# EAGLE design JabberMaster (EAGLE 5.11)
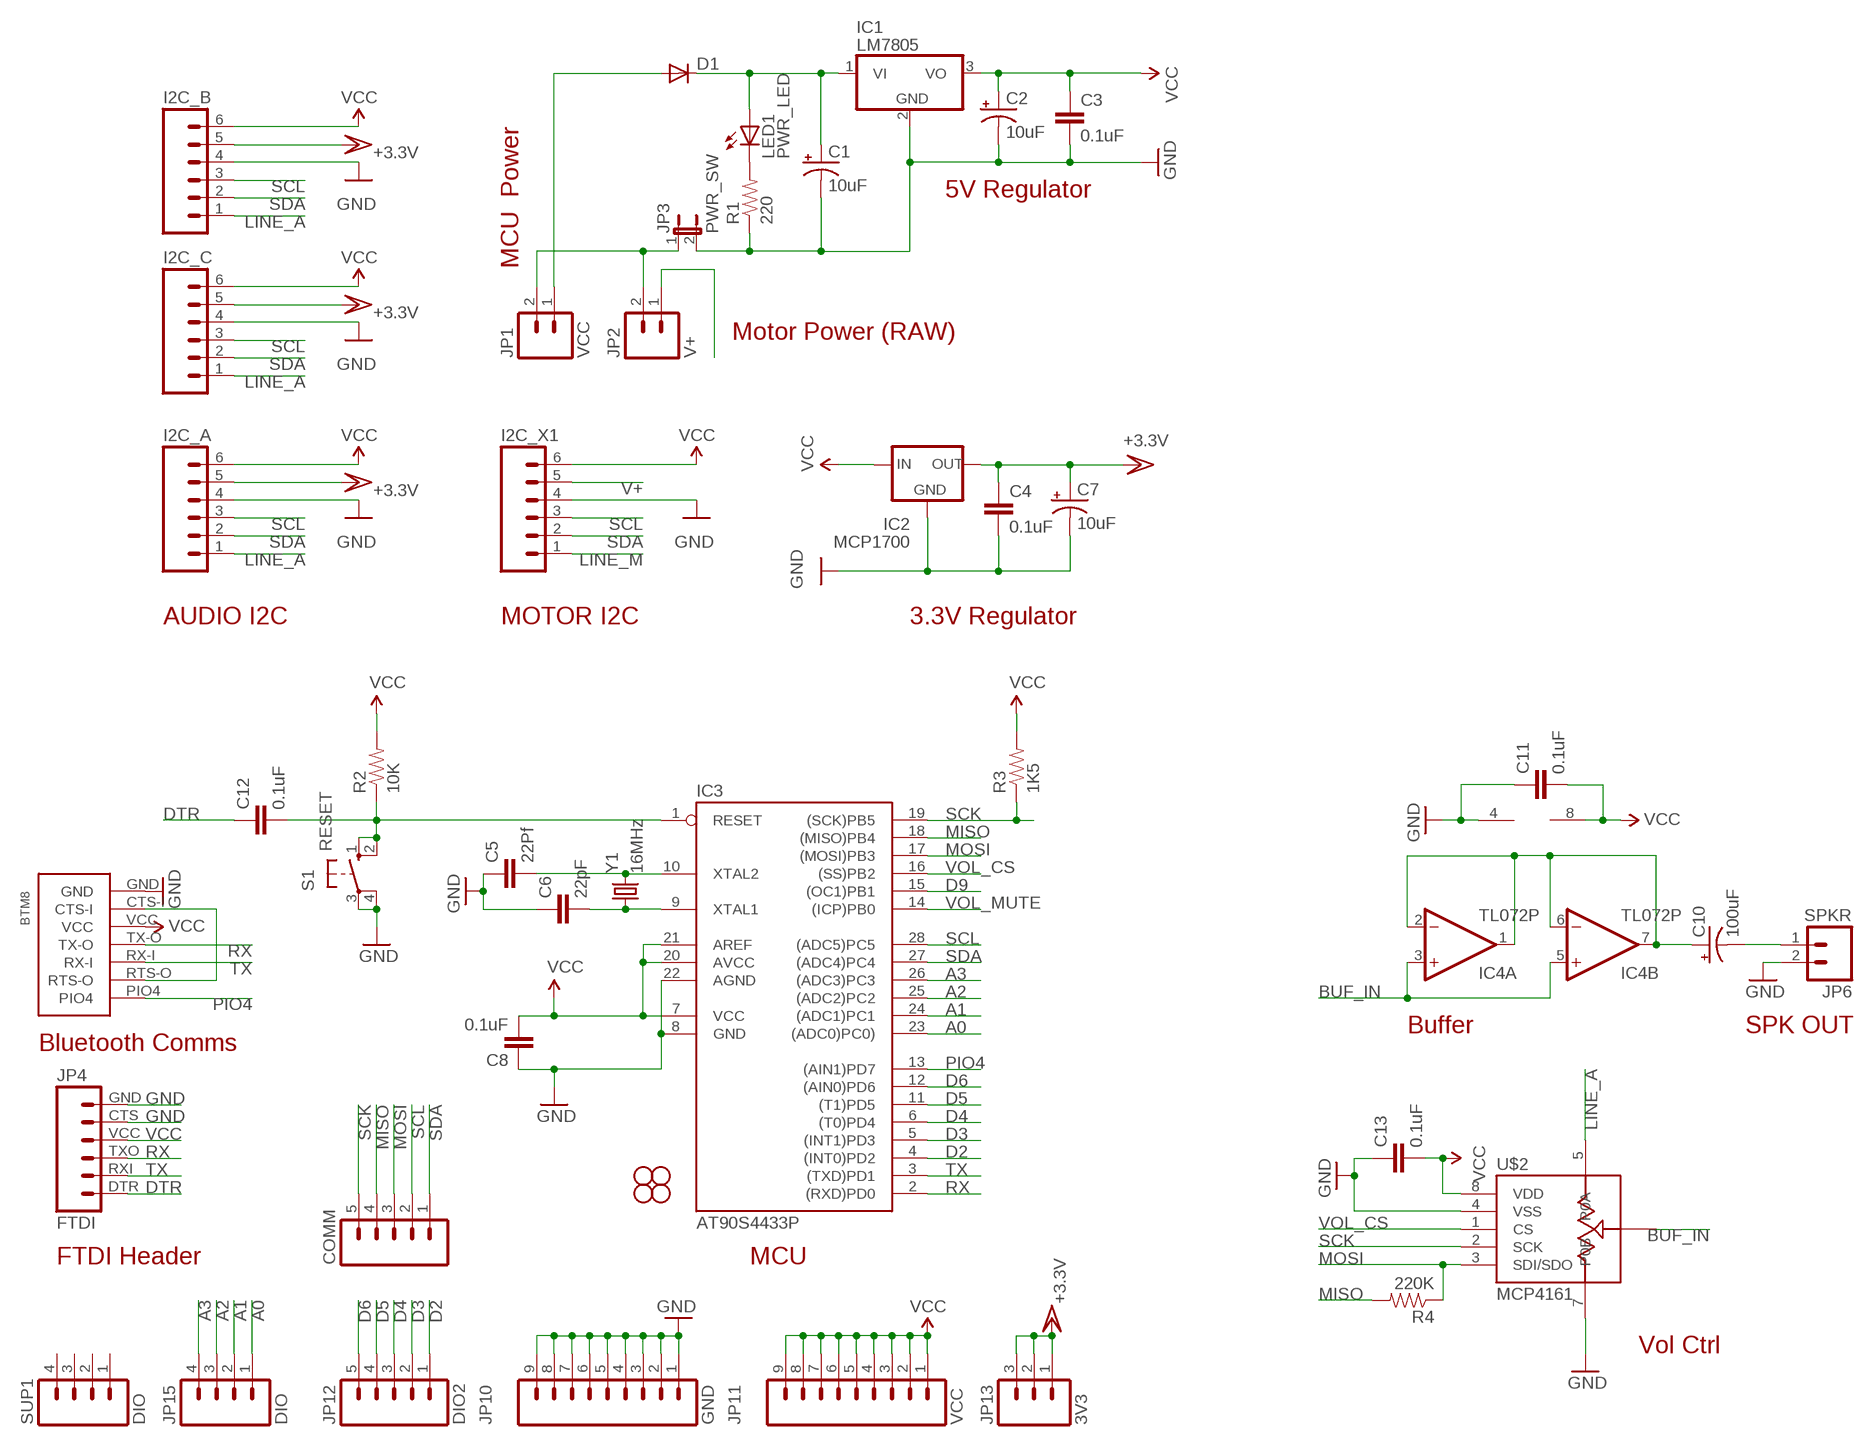
[diagram p0: schematic, sheet 1]

## Parts
BTM8  BLUETOOTH_MATE_SILVER  BLUETOOTH_MATE90FEMALE  [BLUETOOTH_MATE_90FEMALE]
C1  10uF  CAP_POLPTH2  [CPOL-RADIAL-10UF-25V]
C2  10uF  CAP_POLPTH2  [CPOL-RADIAL-10UF-25V]
C3  0.1uF  CAPPTH  [CAP-PTH-SMALL]
C4  0.1uF  CAPPTH  [CAP-PTH-SMALL]
C5  22Pf  CAPPTH  [CAP-PTH-SMALL]
C6  22pF  CAPPTH  [CAP-PTH-SMALL]
C7  10uF  CAP_POLPTH2  [CPOL-RADIAL-10UF-25V]
C8  0.1uF  CAPPTH  [CAP-PTH-SMALL]
C10  100uF  CAP_POLPTH2  [CPOL-RADIAL-10UF-25V]
C11  0.1uF  CAPPTH  [CAP-PTH-SMALL]
C12  0.1uF  CAPPTH  [CAP-PTH-SMALL]
C13  0.1uF  CAPPTH  [CAP-PTH-SMALL]
COMM  M05LOCK  [1X05_LOCK]
D1  DIODE1N4148  [DIODE-1N4148]
I2C_A  M06POLAR_LOCK  [MOLEX-1X6_LOCK]
I2C_B  M06POLAR_LOCK  [MOLEX-1X6_LOCK]
I2C_C  M06POLAR_LOCK  [MOLEX-1X6_LOCK]
I2C_X1  M06POLAR_LOCK  [MOLEX-1X6_LOCK]
IC1  LM7805  7805TV  [TO220V]
IC2  MCP1700  MCP1700INLINE  [TO92-INLINE]
IC3  AT90S4433P  [DIL28-3]
IC4  TL072P  [DIL08]
JP1  VCC  M02POLAR_LOCK  [MOLEX-1X2_LOCK]
JP2  V+  M02POLAR_LOCK  [MOLEX-1X2_LOCK]
JP3  PWR_SW  JUMPER-2PTH  [1X02]
JP4  FTDI  FTDI_BASICPTH  [FTDI_BASIC]
JP5  STAND-OFF  [STAND-OFF]
JP6  SPKR  M02POLAR_LOCK  [MOLEX-1X2_LOCK]
JP7  STAND-OFF  [STAND-OFF]
JP8  STAND-OFF  [STAND-OFF]
JP9  STAND-OFF  [STAND-OFF]
JP10  GND  M09LOCK  [1X09_LOCK]
JP11  VCC  M09LOCK  [1X09_LOCK]
JP12  DIO2  M05LOCK  [1X05_LOCK]
JP13  3V3  M03LOCK  [1X03_LOCK]
JP15  DIO  M04LOCK  [1X04_LOCK]
LED1  PWR_LED  LED3MM  [LED3MM]
R1  220  RESISTORPTH-1/4W  [AXIAL-0.4]
R2  10K  RESISTORAXIAL-0.3  [AXIAL-0.3]
R3  1K5  RESISTORPTH-1/4W  [AXIAL-0.4]
R4  220K  RESISTORAXIAL-0.3  [AXIAL-0.3]
S1  RESET  10-XX  [B3F-10XX]
SUP1  DIO  M04LOCK  [1X04_LOCK]
U$2  MCP4161  MCP416110E/P  [DIL08]
Y1  16MHz  CRYSTALHC49US  [HC49US]

## Nets
A0: IC3.23((ADC0)PC0)) JP15.1
A1: IC3.24((ADC1)PC1) JP15.2
A2: IC3.25((ADC2)PC2) JP15.3
A3: IC3.26((ADC3)PC3) JP15.4
BUF_IN: IC4.3(A:+IN) IC4.5(B:+IN) U$2.6(P0W)
D2: IC3.4((INT0)PD2) JP12.1
D3: IC3.5((INT1)PD3) JP12.2
D4: IC3.6((T0)PD4) JP12.3
D5: IC3.11((T1)PD5) JP12.4
D6: IC3.12((AIN0)PD6) JP12.5
D9: IC3.15((OC1)PB1)
DTR: C12.1 JP4.DTR
GND [power]: BTM8.GND C1.2(-) C2.2(-) C3.2 C4.2 C5.1 C6.1 C7.2(-) C8.1 C11.1 C13.1 I2C_A.4 I2C_B.4 I2C_C.4 I2C_X1.4 IC1.2(GND) IC2.1(GND) IC3.8(GND) IC3.22(AGND) IC4.4(P:V-) JP3.2 JP4.CTS JP4.GND JP6.2 JP10.1 JP10.2 JP10.3 JP10.4 JP10.5 JP10.6 JP10.7 JP10.8 JP10.9 R1.P$1 S1.3(P) S1.4(P1) U$2.4(VSS) U$2.7(P0B)
LINE_A: I2C_A.1 I2C_B.1 I2C_C.1 U$2.5(P0A)
LINE_M: I2C_X1.1
MISO: COMM.4 IC3.18((MISO)PB4) R4.P$2
MOSI: COMM.3 IC3.17((MOSI)PB3) R4.P$1 U$2.3(SDI/SDO)
N$2: C12.2 IC3.1(RESET) R2.P$1 S1.1(S) S1.2(S1)
N$3: D1.A JP1.1
N$4: C1.1(+) D1.C IC1.1(VI) LED1.A
N$5: C10.2(-) JP6.1
N$6: LED1.K(C) R1.P$2
N$7 [power]: JP1.2 JP2.2 JP3.1
N$8: C10.1(+) IC4.1(A:OUT) IC4.2(A:-IN) IC4.6(B:-IN) IC4.7(B:OUT)
N$10: BTM8.CTS-I BTM8.RTS-O
PIO4: BTM8.PIO4 IC3.13((AIN1)PD7)
RX: BTM8.TX-O IC3.2((RXD)PD0) JP4.TXO
SCK: COMM.5 IC3.19((SCK)PB5) R3.P$1 U$2.2(SCK)
SCL: COMM.2 I2C_A.3 I2C_B.3 I2C_C.3 I2C_X1.3 IC3.28((ADC5)PC5)
SDA: COMM.1 I2C_A.2 I2C_B.2 I2C_C.2 I2C_X1.2 IC3.27((ADC4)PC4)
TX: BTM8.RX-I IC3.3((TXD)PD1) JP4.RXI
V+ [power]: I2C_X1.5 JP2.1
VCC: BTM8.VCC C2.1(+) C3.1 C8.2 C11.2 C13.2 I2C_A.6 I2C_B.6 I2C_C.6 I2C_X1.6 IC1.3(VO) IC2.2(IN) IC3.7(VCC) IC3.20(AVCC) IC3.21(AREF) IC4.8(P:V+) JP4.VCC JP11.1 JP11.2 JP11.3 JP11.4 JP11.5 JP11.6 JP11.7 JP11.8 JP11.9 R2.P$2 R3.P$2 U$2.8(VDD)
VCC/2: C4.1 C7.1(+) I2C_A.5 I2C_B.5 I2C_C.5 IC2.3(OUT) JP13.1 JP13.2 JP13.3 ; supply symbol labelled +3.3V
VOL_CS: IC3.16((SS)PB2) U$2.1(CS)
VOL_MUTE: IC3.14((ICP)PB0)
XTAL1: C6.2 IC3.9(XTAL1) Y1.1
XTAL2: C5.2 IC3.10(XTAL2) Y1.2
Unconnected: SUP1.1 SUP1.2 SUP1.3 SUP1.4

## Notes on the sheet
- MCU  Power
- 5V Regulator
- Motor Power (RAW)
- AUDIO I2C | MOTOR I2C | 3.3V Regulator
- Buffer | SPK OUT
- Bluetooth Comms
- FTDI Header | MCU
- Vol Ctrl

## Library data of the parts
BTM8 = Dek:BLUETOOTH_MATE
C1 C2 C7 C10 = SparkFun:CAP_POL: Capacitor Polarized These are standard SMD and PTH capacitors. Normally 10uF, 47uF, and 100uF in electrolytic and tantalum varieties. Always verify the external diameter of the through hole cap, it varies with capacity, voltage, and manufacturer. The EIA devices should be standard.
C3-C6 C8 C11-C13 = SparkFun:CAP: Capacitor Standard 0603 ceramic capacitor, and 0.1" leaded capacitor.
COMM JP12 = SparkFun:M05: Header 5 Standard 5-pin 0.1" header. Use with straight break away headers (SKU : PRT-00116), right angle break away headers (PRT-00553), swiss pins (PRT-00743), machine pins (PRT-00117), and female headers (PRT-00115). Molex polarized connector foot print use with SKU : PRT-08230 with associated crimp pins and housings.
D1 = SparkFun:DIODE: Diode These are standard reverse protection diodes and small signal diodes. SMA package can handle up to about 1A. SOD-323 can handle about 200mA. What the SOD-323 package when ordering, there are some mfgs out there that are 5-pin packages.
I2C_A I2C_B I2C_C I2C_X1 = SparkFun:M06: Header 6 Standard 6-pin 0.1" header. Use with straight break away headers (SKU : PRT-00116), right angle break away headers (PRT-00553), swiss pins (PRT-00743), machine pins (PRT-00117), and female headers (PRT-00115). Molex polarized connector foot print use with SKU : PRT-08094 with associated crimp pins and housings. NOTES ON THE VARIANTS LOCK and LOCK_LONGPADS... This footprint was designed to help hold the alignment of a through-hole component (i.e. 6-pin header) while soldering it into place. You may notice that each hole has been shifted either up or down by 0.005 of an inch from it's more standard position (which is a perfectly straight line). This slight alteration caused the pins (the squares in the middle) to touch the edges of the holes. Because they are alternating, it causes a "brace" to hold the component in place. 0.005 has proven to be the perfect amount of "off-center" position when using our standard breakaway headers. Although looks a little odd when you look at the bare footprint, once you have a header in there, the alteration is very hard to notice. Also, if you push a header all the way into place, it is covered up entirely on the bottom side. This idea of altering the position of holes to aid alignment will be further integrated into the Sparkfun Library for other footprints. It can help hold any component with 3 or more connection pins.
IC1 = linear:78*: Positive VOLTAGE REGULATOR Source: http://cache.national.com/ds/LM/LM78L05.pdf http://www.fairchildsemi.com/ds/LM/LM7805.pdf
IC2 = adafruit:MCP1700: VOLTAGE REGULATOR
IC3 = atmel:AT90S4433: MICROCONTROLLER 4 Kbytes FLASH 128 bytes SRAM 256 bytes EEPROM UART 6-channel 10 bit ADC; OC_FARNELL: unknown; OC_NEWARK: unknown
IC4 = linear:TL072: OP AMP
JP1 JP2 JP6 = SparkFun:M02: Header 2 Standard 2-pin 0.1" header. Use with straight break away headers (SKU : PRT-00116), right angle break away headers (PRT-00553), swiss pins (PRT-00743), machine pins (PRT-00117), and female headers (PRT-00115). Molex polarized connector foot print use with SKU : PRT-08233 with associated crimp pins and housings.
JP3 = SparkFun:JUMPER-2: Jumper Basic 0.1" spaced jumper. Use with breakaway headers.
JP4 = SparkFun:FTDI_BASIC: FTDI Basic: 3.3V and 5V
JP5 JP7-JP9 = SparkFun:STAND-OFF: Stand Off This is the mechanical footprint for a #4 phillips button head screw. Use the keepout ring to avoid running the screw head into surrounding components. SKU : PRT-00447
JP10 JP11 = SparkFun:M09: Header 9 Standard 9-pin 0.1" header. Use with straight break away headers (SKU : PRT-00116), right angle break away headers (PRT-00553), swiss pins (PRT-00743), machine pins (PRT-00117), and female headers (PRT-00115).
JP13 = SparkFun:M03: Header 3 Standard 3-pin 0.1" header. Use with straight break away headers (SKU : PRT-00116), right angle break away headers (PRT-00553), swiss pins (PRT-00743), machine pins (PRT-00117), and female headers (PRT-00115). Molex polarized connector foot print use with SKU : PRT-08232 with associated crimp pins and housings.
JP15 SUP1 = SparkFun:M04: Header 4 Standard 4-pin 0.1" header. Use with straight break away headers (SKU : PRT-00116), right angle break away headers (PRT-00553), swiss pins (PRT-00743), machine pins (PRT-00117), and female headers (PRT-00115). Molex polarized connector foot print use with SKU : PRT-08231 with associated crimp pins and housings. 1MM SMD Version SKU: PRT-10208
LED1 = SparkFun:LED: LEDs Standard schematic elements and footprints for 5mm, 3mm, 1206, and 0603 sized LEDs. 5mm - Spark Fun Electronics SKU : COM-00529 (and others)
R1-R4 = SparkFun:RESISTOR: Resistor Basic schematic elements and footprints for 0603, 1206, and PTH resistors.
S1 = switch-omron:10-XX: OMRON SWITCH; MPN: B3F-1000; OC_FARNELL: 176432; OC_NEWARK: 36M3542
U$2 = Dek:MCP4161
Y1 = SparkFun:CRYSTAL: Crystals Various standard crystals. Proven footprints. Spark Fun Electronics SKU : COM-00534

## Net classes
1 power: width 0.813 mm, clearance 0.508 mm

## Board
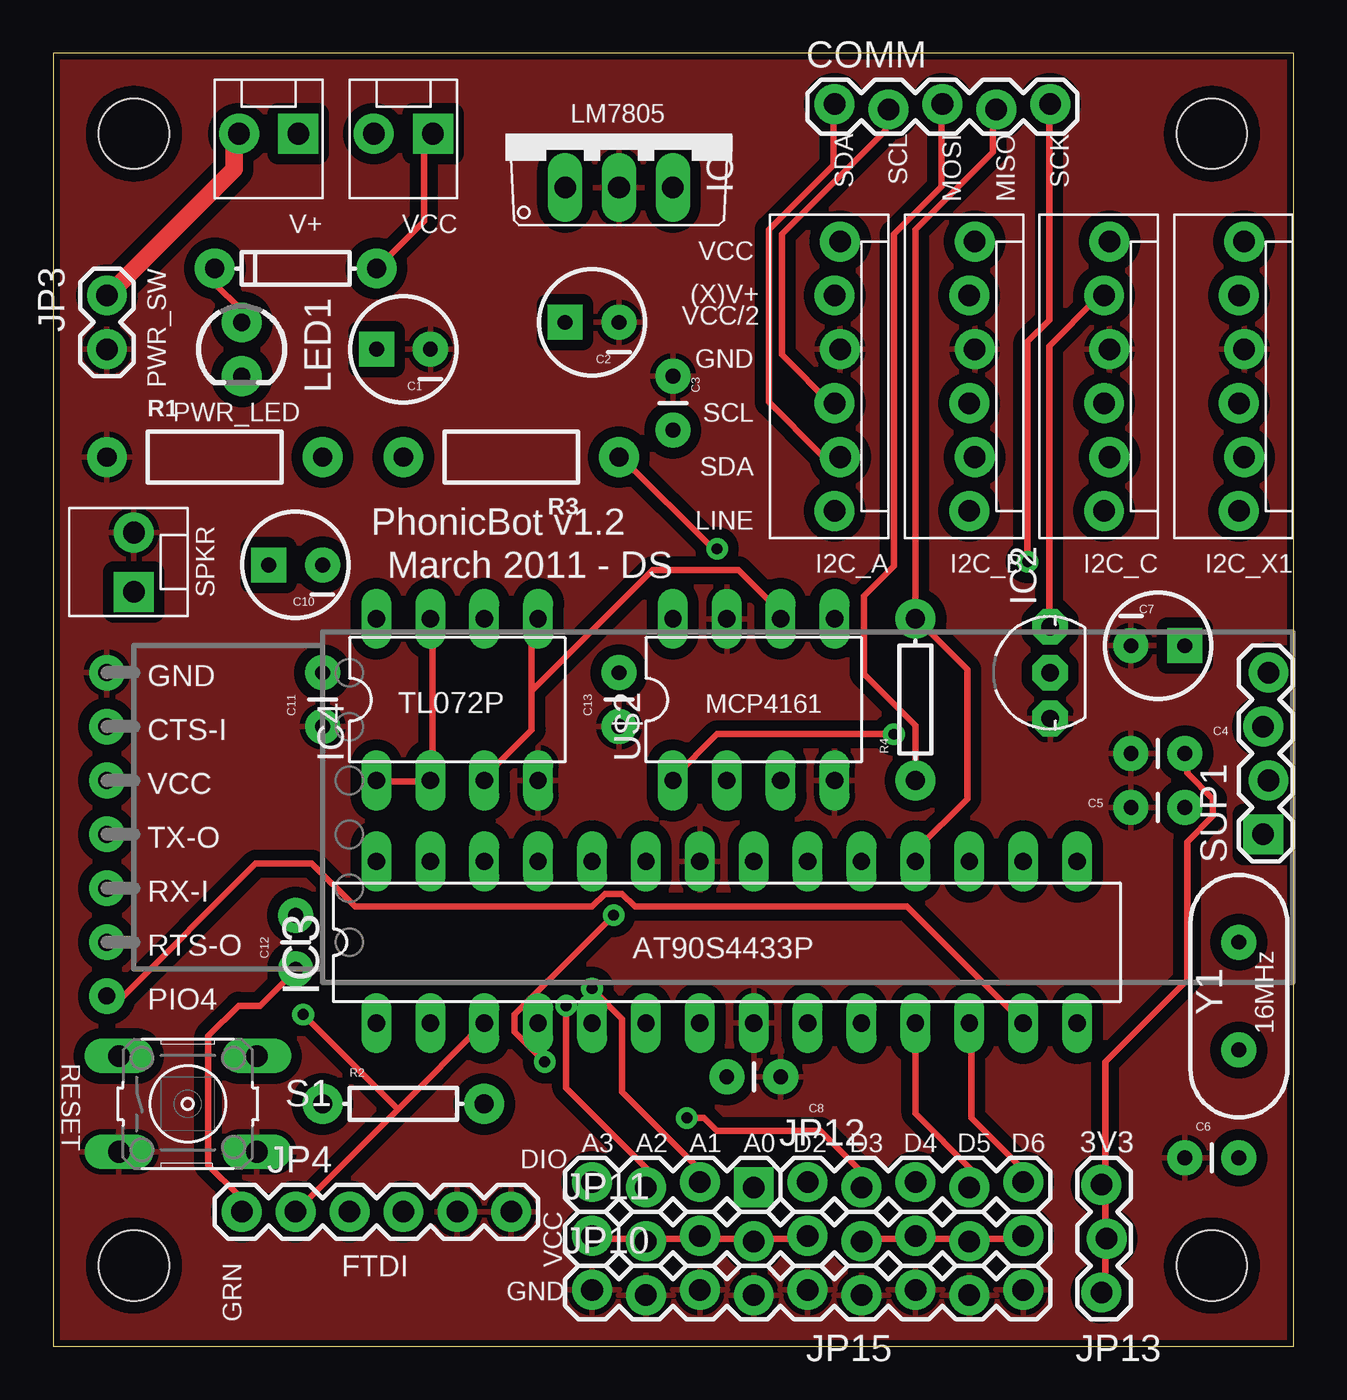
[diagram p1: board, top side]
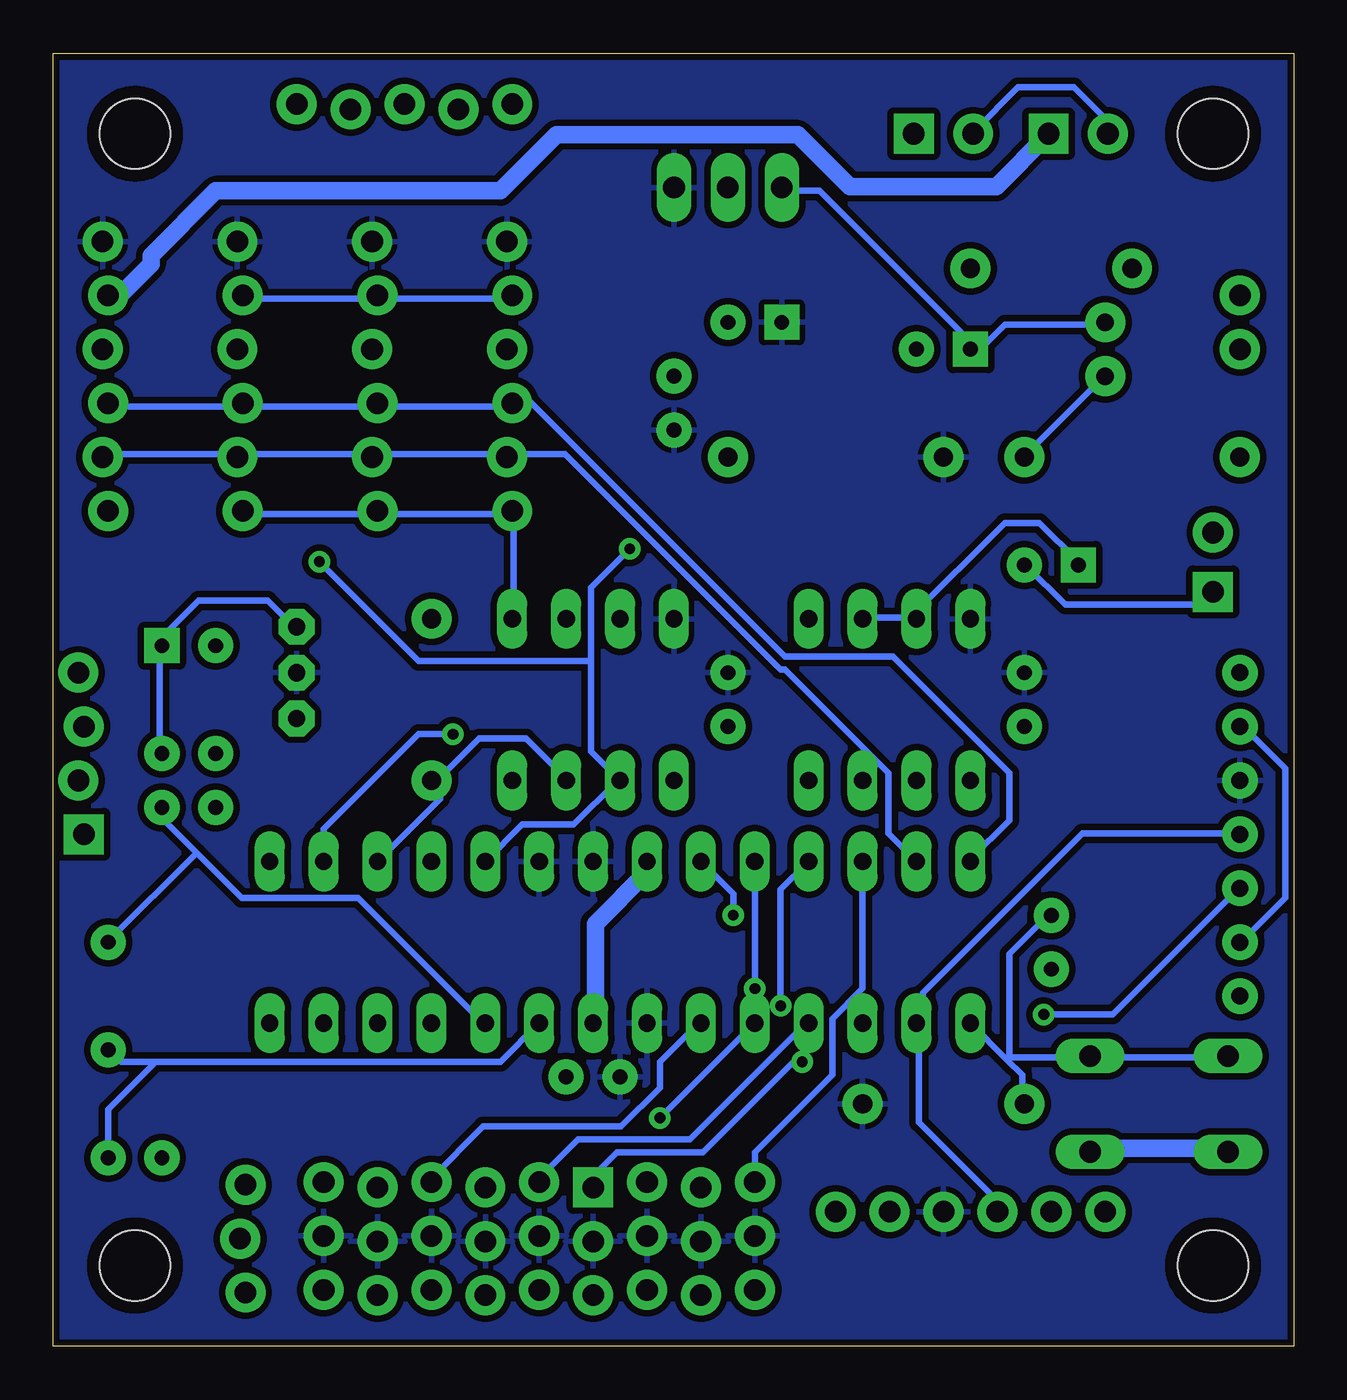
[diagram p2: board, bottom side, seen from below]

Size 58.47 x 60.95 mm. Coordinates in mm from the lower left corner, seen from the top.
Outline: 0,0 58.47,0 58.47,60.95 0,60.95 0,0
Copper layers (1*16): Top 0.035mm / dielectric 1.5mm / Bottom 0.035mm
Design rules "SparkFun": minimum track width 12mil, minimum drill 20mil, track to track 8mil, track to pad 8mil, pad to pad 8mil, via to via 8mil, smd to smd 8mil, copper to edge 10mil, drill to drill 8mil, minimum pad ring 12mil, minimum via ring 10mil, stop-mask expansion 4mil, vias tented up to drill 25mil, thermal gap 10mil

### Footprints (pad centres in the part's own frame; a part is rotated, then mirrored left to right if it is on the bottom)
BLUETOOTH_MATE_90FEMALE = drill 0.8 pad 1.676 round: CTS-I 0,10.16; GND 0,12.7; PIO4 0,-2.54; RTS-O 0,0; RX-I 0,2.54; TX-O 0,5.08; VCC 0,7.62
CPOL-RADIAL-10UF-25V = drill 0.7 pad 1.651 square: 1 1.27,0 | drill 0.7 pad 1.651 round: 2 -1.27,0
CAP-PTH-SMALL = drill 0.7 pad 1.651 round: 1 0,0; 2 2.54,0
1X05_LOCK = drill 1.016 pad 1.88 round: 1 0,0.127; 2 2.54,-0.127; 3 5.08,0.127; 4 7.62,-0.127; 5 10.16,0.127
DIODE-1N4148 = drill 0.9 pad 1.88 round: A -3.81,0; C 3.81,0
MOLEX-1X6_LOCK = drill 1.016 pad 1.88 round: 1 0,0; 2 2.54,-0.254; 3 5.08,0; 4 7.62,-0.254; 5 10.16,0; 6 12.7,-0.254
TO220V = drill 1.016 long: 1 -2.54,-2.54; 2 0,-2.54; 3 2.54,-2.54
TO92-INLINE = drill 0.813 pad 1.676 octagon: 1 -2.159,0; 2 0,0; 3 2.159,0
DIL28-3 = drill 0.813 long: 1 -16.51,-3.81; 2 -13.97,-3.81; 3 -11.43,-3.81; 4 -8.89,-3.81; 5 -6.35,-3.81; 6 -3.81,-3.81; 7 -1.27,-3.81; 8 1.27,-3.81; 9 3.81,-3.81; 10 6.35,-3.81; 11 8.89,-3.81; 12 11.43,-3.81; 13 13.97,-3.81; 14 16.51,-3.81; 15 16.51,3.81; 16 13.97,3.81; 17 11.43,3.81; 18 8.89,3.81; 19 6.35,3.81; 20 3.81,3.81; 21 1.27,3.81; 22 -1.27,3.81; 23 -3.81,3.81; 24 -6.35,3.81; 25 -8.89,3.81; 26 -11.43,3.81; 27 -13.97,3.81; 28 -16.51,3.81
DIL08 = drill 0.813 long: 1 -3.81,-3.81; 2 -1.27,-3.81; 3 1.27,-3.81; 4 3.81,-3.81; 5 3.81,3.81; 6 1.27,3.81; 7 -1.27,3.81; 8 -3.81,3.81
MOLEX-1X2_LOCK = drill 1.016 pad 1.88 square: 1 -0.127,0 | drill 1.016 pad 1.88 round: 2 2.667,0
1X02 = drill 1.016 pad 1.88 round: 1 0,0; 2 2.54,0
FTDI_BASIC = drill 1.016 pad 1.88 round: CTS 10.16,0; DTR 0,0; GND 12.7,0; RXI 2.54,0; TXO 5.08,0; VCC 7.62,0
STAND-OFF = hole 3.302: 0,0
1X09_LOCK = drill 1.016 pad 1.88 round: 1 0,0.127; 2 2.54,-0.127; 3 5.08,0.127; 4 7.62,-0.127; 5 10.16,0.127; 6 12.7,-0.127; 7 15.24,0.127; 8 17.78,-0.127; 9 20.32,0.127
1X03_LOCK = drill 1.016 pad 1.88 round: 1 0,0.127; 2 2.54,-0.127; 3 5.08,0.127
1X04_LOCK = drill 1.016 pad 1.88 square: 1 0,0.127 | drill 1.016 pad 1.88 round: 2 2.54,-0.127; 3 5.08,0.127; 4 7.62,-0.127
LED3MM = drill 0.813 pad 1.88 round: A -1.27,0; K 1.27,0
AXIAL-0.4 = drill 0.9 pad 1.88 round: P$1 -5.08,0; P$2 5.08,0
AXIAL-0.3 = drill 0.9 pad 1.88 round: P$1 -3.81,0; P$2 3.81,0
B3F-10XX = drill 1.016 long: 1 -3.251,2.261; 2 3.251,2.261; 3 -3.251,-2.261; 4 3.251,-2.261
HC49US = drill 0.7 pad 1.651 round: 1 -2.54,0; 2 2.54,0

### Placement (x,y rotation side)
BTM8  2.54,19.05 0 top
C1  16.51,46.99 180 top
C2  25.4,48.26 180 top
C3  29.21,43.18 90 top
C4  53.34,27.94 180 top
C5  50.8,25.4 0 top
C6  53.34,8.89 0 top
C7  52.07,33.02 0 top
C8  34.29,12.7 180 top
C10  11.43,36.83 180 top
C11  12.7,29.21 90 top
C12  11.43,17.78 90 top
C13  26.67,29.21 90 top
COMM  36.83,58.42 0 top
D1  11.43,50.8 180 top
I2C_A  36.83,39.37 90 top
I2C_B  43.18,39.37 90 top
I2C_C  49.53,39.37 90 top
I2C_X1  55.88,39.37 90 top
IC1  26.67,57.15 0 top
IC2  46.99,31.75 90 top
IC3  31.75,19.05 0 top
IC4  19.05,30.48 0 top
JP1  17.78,57.15 180 top
JP2  11.43,57.15 180 top
JP3  2.54,49.53 270 top
JP4  8.89,6.35 0 top
JP5  54.61,3.81 0 top
JP6  3.81,35.69 90 top
JP7  54.61,57.15 0 top
JP8  3.81,3.81 0 top
JP9  3.81,57.15 0 top
JP10  25.4,2.54 0 top
JP11  25.4,5.08 0 top
JP12  35.56,7.62 0 top
JP13  49.53,2.54 90 top
JP15  33.02,7.62 180 top
LED1  8.89,46.99 270 top
R1  7.62,41.91 0 top
R2  16.51,11.43 0 top
R3  21.59,41.91 180 top
R4  40.64,30.48 90 top
S1  6.35,11.43 0 top
SUP1  57.15,24.13 90 top
U$2  33.02,30.48 0 top
Y1  55.88,16.51 90 top

### Tracks (layer width: path | path; a pad name or v marks a point on that pad's centre or on a via)
A0  (via drill 0.51)
  Top 0.305: v26.42,20.32 21.74,15.65 21.74,14.83 v23.16,13.41
  Bottom 0.305: v26.42,20.32 26.42,21.34 IC3.23 | v23.16,13.41 23.57,13.41 27.84,9.14 31.9,9.14 32.92,8.13 32.92,7.52 JP15.1
A1  (via drill 0.51)
  Top 0.305: v25.4,16.87 26.82,15.44 26.82,11.99 30.48,8.33 JP15.2
  Bottom 0.305: v25.4,16.87 IC3.24
A2  (via drill 0.51)
  Top 0.305: v24.18,16.05 24.18,12.19 28.04,8.33 28.04,7.52 JP15.3
  Bottom 0.305: v24.18,16.05 24.18,21.54 IC3.25
A3
  Bottom 0.305: IC3.26 20.32,16.87 21.74,15.44 21.74,12.8 25.4,9.14 JP15.4
BUF_IN
  Top 0.305: 22.55,30.89 22.55,33.93 22.76,34.14 IC4.5 | 22.55,30.89 22.55,29.06 20.32,26.82 IC4.3 | 22.55,30.89 28.25,36.58 32.31,36.58 34.14,34.75 34.14,34.34 U$2.6
D2
  Bottom 0.305: IC3.4 22.96,15.24 28.45,9.75 33.73,9.75 35.56,7.92 JP12.1
D3  (via drill 0.51)
  Top 0.305: v29.87,10.77 30.68,10.77 31.29,10.16 36.17,10.16 38,8.33 38,7.52 JP12.2
  Bottom 0.305: v29.87,10.77 IC3.5
D4
  Bottom 0.305: IC3.6 28.04,15.24 29.87,13.41 29.87,12.19 31.7,10.36 38.2,10.36 40.64,7.92 JP12.3
D5
  Top 0.305: IC3.11 40.64,10.97 43.28,8.33 43.28,7.52 JP12.4
D6
  Top 0.305: IC3.12 43.28,15.24 43.28,10.77 45.72,8.33 JP12.5
DTR
  Top 0.305: C12.1 11.38,17.68 9.75,16.05 8.74,16.05 7.32,14.63 7.32,8.53 8.74,7.11 8.74,6.5 JP4.DTR
GND
  Bottom 0.813: IC3.8 32.92,15.24 32.92,19.91 30.48,22.35 IC3.22 | S1.4 9.55,9.35 3.25,9.35 S1.3
  pour Top (isolate 0.305): -2.54,62.23 59.69,62.23 59.69,-1.27 -2.54,-1.27
LINE_A
  Bottom 0.305: U$2.5 36.78,34.34 36.78,39.22 I2C_A.1 36.98,39.22 43.08,39.22 I2C_B.1 43.28,39.22 49.38,39.22 I2C_C.1
MISO
  Top 0.305: 40.64,34.34 43.08,31.9 43.08,25.81 40.64,23.37 IC3.18 | 40.64,34.34 40.64,52.63 44.3,56.29 44.3,58.12 COMM.4 | 40.64,34.34 R4.P$2
MOSI
  Top 0.305: COMM.3 41.86,58.52 41.86,54.66 39.62,52.43 39.62,36.78 38.2,35.36 38.2,31.7 40.64,29.26 R4.P$1
  Bottom 0.305: 40.23,26.82 38.41,28.65 36.17,28.65 34.34,26.82 U$2.3 | 40.23,26.82 40.64,26.82 R4.P$1 40.23,26.82 | 40.23,26.82 40.23,25.81 IC3.17
N$2
  Bottom 0.305: S1.1 3.25,13.61 9.55,13.61 S1.2 9.75,13.61 13.41,13.61 | 13.51,13.51 12.8,12.8 12.8,11.58 R2.P$1 | 13.51,13.51 IC3.1 | 13.41,13.61 13.41,18.49 11.58,20.32 C12.2 | 13.41,13.61 13.51,13.51
N$3
  Top 0.305: D1.A 17.48,53.03 17.48,56.69 17.88,57.1 JP1.1
N$4
  Top 0.305: LED1.A 8.74,48.36 8.74,48.97 7.72,49.99 7.72,50.8 D1.C
  Bottom 0.305: 15.24,47.14 15.24,47.35 22.35,54.46 23.98,54.46 IC1.1 | 15.24,47.14 14.63,47.14 13.61,48.16 8.94,48.16 LED1.A | 15.24,47.14 C1.1
N$5
  Bottom 0.305: C10.2 12.6,36.78 10.77,34.95 4.47,34.95 3.86,35.56 JP6.1
N$6
  Bottom 0.305: R1.P$2 12.6,42.06 8.94,45.72 LED1.K
N$7
  Top 0.813: JP3.1 2.64,49.58 8.53,55.47 8.53,56.9 8.74,57.1 JP2.2
  Bottom 0.305: JP1.2 15.04,57.3 13.01,59.33 10.36,59.33 8.94,57.91 8.94,57.3 JP2.2
N$8
  Top 0.305: IC4.1 15.24,26.62 17.68,26.62 IC4.2 17.88,26.82 17.88,34.14 IC4.7
  Bottom 0.305: 18.09,34.34 20.32,34.34 IC4.6 | 18.09,34.34 17.88,34.34 IC4.7 18.09,34.34 | 18.09,34.34 13.61,38.81 11.99,38.81 10.16,36.98 C10.1
N$10
  Bottom 0.305: BTM8.RTS-O 2.44,19.1 0.41,21.13 0.41,27.23 2.44,29.26 BTM8.CTS-I
PIO4
  Top 0.305: IC3.13 40.23,20.73 27.43,20.73 26.82,21.34 26.01,21.34 25.4,20.73 14.22,20.73 12.19,22.76 9.55,22.76 3.25,16.46 2.64,16.46 BTM8.PIO4
RX
  Bottom 0.305: 17.68,15.24 17.68,10.57 14.02,6.91 14.02,6.5 JP4.TXO | 17.68,15.24 17.48,15.44 17.48,16.66 9.96,24.18 2.64,24.18 BTM8.TX-O | 17.68,15.24 IC3.2
SCK  (via drill 0.51)
  Top 0.305: v31.29,37.59 31.09,37.59 26.82,41.86 R3.P$1 | v45.92,36.98 45.92,47.35 46.94,48.36 46.94,58.52 COMM.5
  Bottom 0.305: IC3.19 36.37,24.59 33.93,24.59 31.9,26.62 U$2.2 33.12,28.04 33.12,32.31 | v31.29,37.59 33.12,35.76 33.12,32.31 | v45.92,36.98 41.25,32.31 33.12,32.31
SCL
  Top 0.305: COMM.2 39.22,58.12 39.22,57.3 34.34,52.43 34.34,46.74 36.78,44.3 I2C_A.3
  Bottom 0.305: I2C_X1.3 55.88,44.3 49.58,44.3 I2C_C.3 49.38,44.3 43.28,44.3 I2C_B.3 43.08,44.3 36.98,44.3 I2C_A.3 36.78,44.5 35.97,44.5 23.98,32.51 18.9,32.51 13.41,27.03 13.41,24.79 15.24,22.96 IC3.28
SDA
  Top 0.305: COMM.1 36.78,58.52 36.78,55.68 33.73,52.63 33.73,44.5 36.17,42.06 36.98,42.06 I2C_A.2
  Bottom 0.305: IC3.27 19.1,24.18 19.1,27.03 23.98,31.9 24.18,31.9 34.34,42.06 36.98,42.06 I2C_A.2 37.19,42.06 43.28,42.06 I2C_B.2 43.48,42.06 49.78,42.06 | 49.78,42.06 56.08,42.06 I2C_X1.2 | 49.78,42.06 I2C_C.2
TX  (via drill 0.51)
  Top 0.305: 16.26,11.18 IC3.3 | JP4.RXI 16.26,11.18 | 16.26,11.18 v11.79,15.65
  Bottom 0.305: v11.79,15.65 8.53,15.65 2.64,21.54 BTM8.RX-I
V+
  Bottom 0.813: JP2.1 11.58,57.1 14.02,54.66 20.93,54.66 23.37,57.1 34.75,57.1 37.39,54.46 50.8,54.46 53.85,51.41 53.85,51 55.27,49.58 55.88,49.58 I2C_X1.5
VCC
  Top 0.305: JP11.5 35.56,5.08 33.12,5.08 JP11.4 32.92,5.08 30.48,5.08 | 30.48,5.08 28.04,5.08 JP11.2 27.84,5.08 25.4,5.08 JP11.1 | JP11.9 45.72,5.08 43.28,5.08 JP11.8 43.08,5.08 40.64,5.08 | 40.64,5.08 38.2,5.08 JP11.6 | 40.64,5.08 JP11.7 | 30.48,5.08 JP11.3
  pour Bottom (isolate 0.305): -1.27,62.23 59.69,62.23 59.69,-1.27 -1.27,-1.27
VCC/2
  Top 0.305: 49.58,5.08 49.58,2.64 JP13.1 | 49.58,5.08 49.58,7.52 JP13.3 49.58,7.72 49.58,13.41 53.44,17.27 53.44,23.77 54.66,24.99 54.66,25.81 53.44,27.03 53.44,27.84 C4.1 | 49.58,5.08 JP13.2 | I2C_C.5 49.38,49.38 49.17,49.38 46.94,47.14 46.94,33.93 IC2.3
  Bottom 0.305: I2C_A.5 36.98,49.38 43.08,49.38 I2C_B.5 43.28,49.38 49.38,49.38 I2C_C.5 | C4.1 53.44,28.04 53.44,32.92 C7.1 53.24,33.12 53.24,33.53 51.61,35.15 48.36,35.15 47.14,33.93 IC2.3
VOL_CS  (via drill 0.51)
  Top 0.305: v39.62,28.85 31.29,28.85 29.26,26.82 U$2.1
  Bottom 0.305: v39.62,28.85 41.25,28.85 45.72,24.38 IC3.16
XTAL1
  Bottom 0.305: IC3.9 37.39,13.41 53.65,13.41 | 53.65,13.41 55.27,13.41 55.88,14.02 Y1.1 | 53.65,13.41 55.88,11.18 C6.2
XTAL2
  Bottom 0.305: 51.71,23.27 53.24,24.79 53.24,25.4 C5.2 | 51.71,23.27 49.58,21.13 44.09,21.13 38.2,15.24 IC3.10 | Y1.2 55.88,19.1 51.71,23.27

### Text on the board
tPlace: SDA | SCL | MOSI | MISO | SCK | V+ | VCC | VCC | (X)V+ | VCC/2 | GND | SCL | SDA | LINE | PhonicBot v1.2 | March 2011 - DS | SPKR | A3 | A2 | A1 | A0 | D2 | D3 | D4 | D5 | D6 | GRN